# EAGLE design power_v2 (EAGLE 6.2)
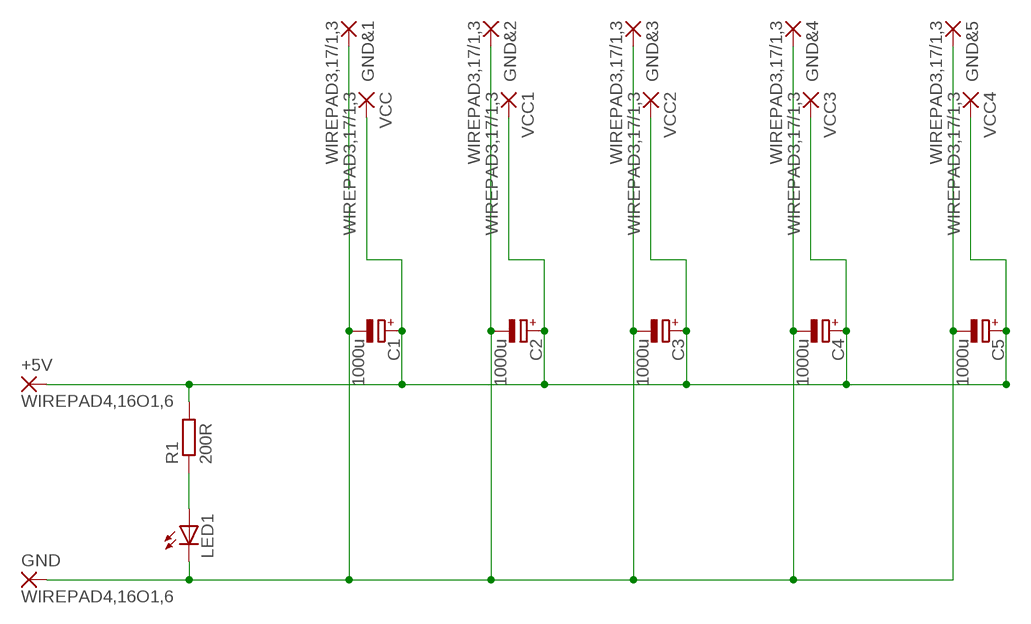
[diagram p0: schematic, sheet 1]

## Parts
+5V  WIREPAD4,16O1,6  [4,16O1,6]
C1  1000u  CPOL-EUE5-10.5  [E5-10,5]
C2  1000u  CPOL-EUE5-10.5  [E5-10,5]
C3  1000u  CPOL-EUE5-10.5  [E5-10,5]
C4  1000u  CPOL-EUE5-10.5  [E5-10,5]
C5  1000u  CPOL-EUE5-10.5  [E5-10,5]
GND  WIREPAD4,16O1,6  [4,16O1,6]
GND&1  WIREPAD3,17/1,3  [3,17/1,3]
GND&2  WIREPAD3,17/1,3  [3,17/1,3]
GND&3  WIREPAD3,17/1,3  [3,17/1,3]
GND&4  WIREPAD3,17/1,3  [3,17/1,3]
GND&5  WIREPAD3,17/1,3  [3,17/1,3]
LED1  LED5MM  [LED5MM]
R1  200R  R-EU_R1206  [R1206]
VCC  WIREPAD3,17/1,3  [3,17/1,3]
VCC1  WIREPAD3,17/1,3  [3,17/1,3]
VCC2  WIREPAD3,17/1,3  [3,17/1,3]
VCC3  WIREPAD3,17/1,3  [3,17/1,3]
VCC4  WIREPAD3,17/1,3  [3,17/1,3]

## Nets
GND: C1.- C2.- C3.- C4.- C5.- GND&2.1(P) GND&3.1(P) GND&4.1(P) GND&5.1(P) GND.1(P) LED1.K(C)
N$1: GND&1.1(P)
N$2: LED1.A R1.1
N$6: +5V.1(P) C1.+ C2.+ C3.+ C4.+ C5.+ R1.2 VCC1.1(P) VCC2.1(P) VCC3.1(P) VCC4.1(P) VCC.1(P)

## Library data of the parts
+5V GND GND&1-GND&5 VCC VCC1-VCC4 = wirepad:WIREPAD: Wire PAD connect wire on PCB
C1-C5 = resistor:CPOL-EU: POLARIZED CAPACITOR, European symbol
LED1 = led:LED: LED OSRAM: - CHIPLED LG R971, LG N971, LY N971, LG Q971, LY Q971, LO R971, LY R971 LH N974, LH R974 LS Q976, LO Q976, LY Q976 LO Q996 - Hyper CHIPLED LW Q18S LB Q993, LB Q99A, LB R99A - SideLED LS A670, LO A670, LY A670, LG A670, LP A670 LB A673, LV A673, LT A673, LW A673 LH A674 LY A675 LS A676, LA A676, LO A676, LY A676, LW A676 LS A679, LY A679, LG A679 - Hyper Micro SIDELED® LS Y876, LA Y876, LO Y876, LY Y876 LT Y87S - SmartLED LW L88C, LW L88S LB L89C, LB L89S, LG L890 LS L89K, LO L89K, LY L89K LS L896, LA L896, LO L896, LY L896 - TOPLED LS T670, LO T670, LY T670, LG T670, LP T670 LSG T670, LSP T670, LSY T670, LOP T670, LYG T670 LG T671, LOG T671, LSG T671 LB T673, LV T673, LT T673, LW T673 LH T674 LS T676, LA T676, LO T676, LY T676, LB T676, LH T676, LSB T676, LW T676 LB T67C, LV T67C, LT T67C, LS T67K, LO T67K, LY T67K, LW E67C LS E67B, LA E67B, LO E67B, LY E67B, LB E67C, LV E67C, LT E67C LW T67C LS T679, LY T679, LG T679 LS T770, LO T770, LY T770, LG T770, LP T770 LB T773, LV T773, LT T773, LW T773 LH T774 LS E675, LA E675, LY E675, LS T675 LS T776, LA T776, LO T776, LY T776, LB T776 LHGB T686 LT T68C, LB T68C - Hyper Mini TOPLED® LB M676 - Mini TOPLED Santana® LG M470 LS M47K, LO M47K, LY M47K Source: http://www.osram.convergy.de LUXEON: - LUMILED® LXK2-PW12-R00, LXK2-PW12-S00, LXK2-PW14-U00, LXK2-PW14-V00 LXK2-PM12-R00, LXK2-PM12-S00, LXK2-PM14-U00 LXK2-PE12-Q00, LXK2-PE12-R00, LXK2-PE12-S00, LXK2-PE14-T00, LXK2-PE14-U00 LXK2-PB12-K00, LXK2-PB12-L00, LXK2-PB12-M00, LXK2-PB14-N00, LXK2-PB14-P00, LXK2-PB14-Q00 LXK2-PR12-L00, LXK2-PR12-M00, LXK2-PR14-Q00, LXK2-PR14-R00 LXK2-PD12-Q00, LXK2-PD12-R00, LXK2-PD12-S00 LXK2-PH12-R00, LXK2-PH12-S00 LXK2-PL12-P00, LXK2-PL12-Q00, LXK2-PL12-R00 Source: www.luxeon.com KINGBRIGHT: KA-3528ASYC Source: www.kingbright.com
R1 = resistor:R-EU_: RESISTOR, European symbol

## Board
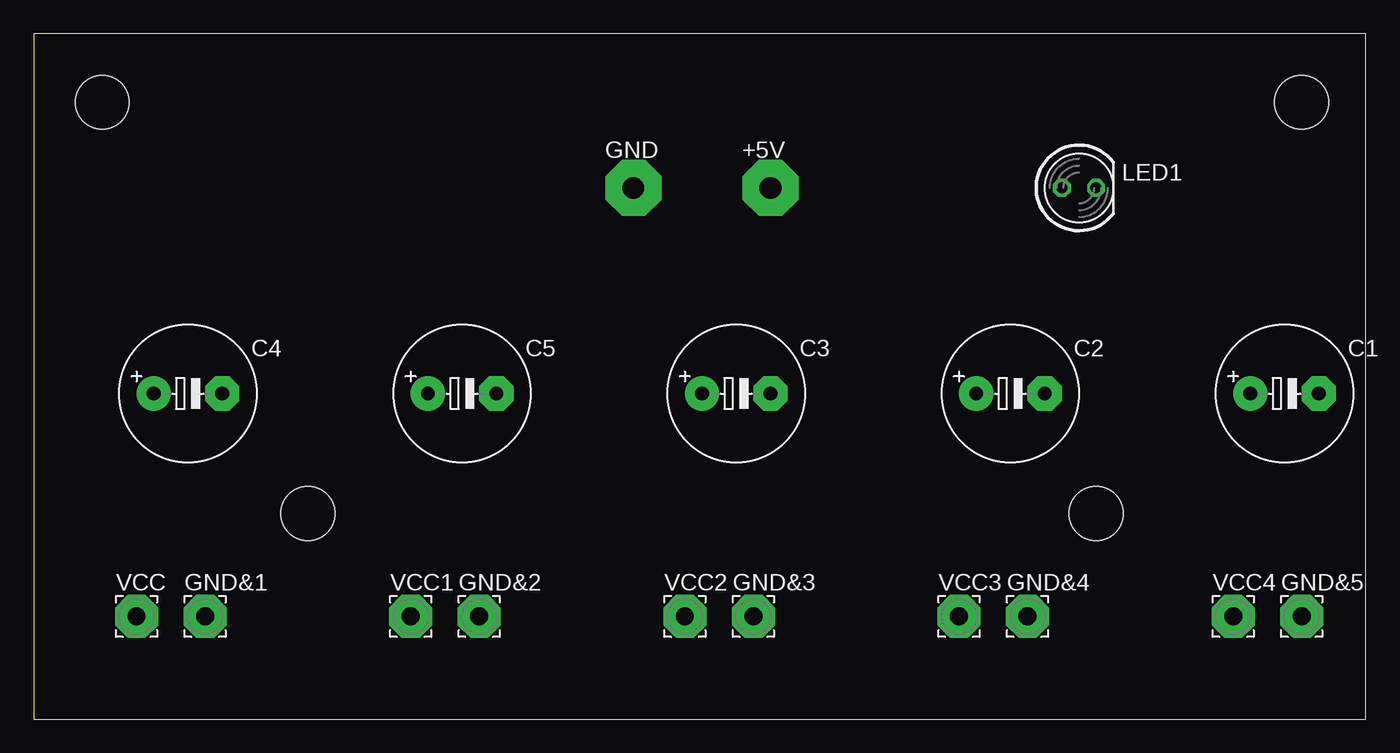
[diagram p1: board, top side]
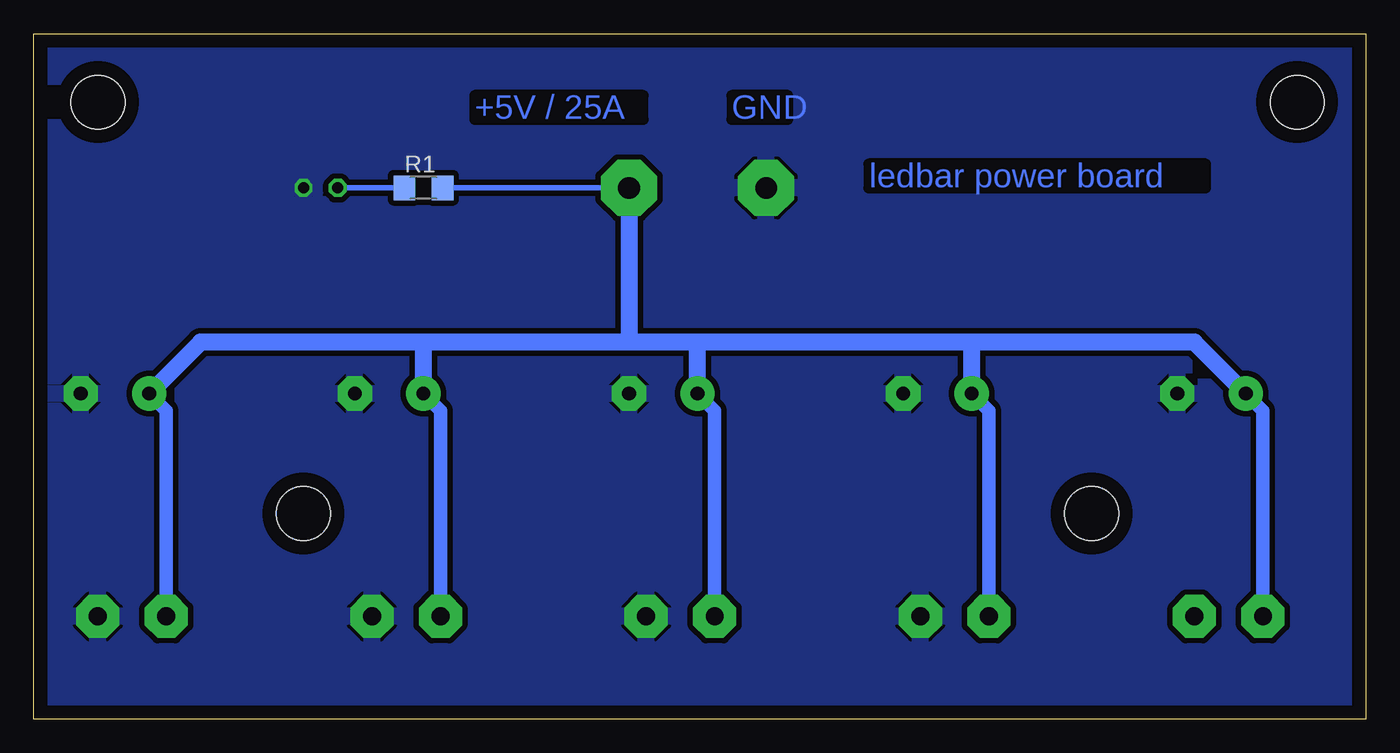
[diagram p2: board, bottom side, seen from below]

Size 98.73 x 50.79 mm. Coordinates in mm from the lower left corner, seen from the top.
Outline: 0,0 98.73,0 98.73,50.79 0,50.79 0,0
Copper layers (1*16): Top 0.035mm / dielectric 1.5mm / Bottom 0.035mm
Design rules: minimum track width 10mil, minimum drill 24mil, track to track 16mil, track to pad 16mil, pad to pad 16mil, via to via 16mil, smd to smd 8mil, copper to edge 40mil, drill to drill 8mil, minimum pad ring 10mil, minimum via ring 8mil, stop-mask expansion 4mil, vias tented up to drill 0mil, thermal gap 10mil
Holes 4 mm at 5.08,45.72 93.98,45.72 20.32,15.24 78.74,15.24

### Footprints (pad centres in the part's own frame; a part is rotated, then mirrored left to right if it is on the bottom)
4,16O1,6 = drill 1.6 pad 4.166 octagon: 1 0,0
E5-10,5 = drill 1.016 pad 2.54: + -2.54,0 | drill 1.016 pad 2.54 octagon: - 2.54,0
3,17/1,3 = drill 1.321 pad 3.175 octagon: 1 0,0
LED5MM = drill 0.813 octagon: A -1.27,0; K 1.27,0
R1206 = smd 1.6 x 1.803: 1 -1.422,0; 2 1.422,0

### Placement (x,y rotation side)
+5V  54.61,39.37 0 top
C1  92.71,24.13 0 top
C2  72.39,24.13 0 top
C3  52.07,24.13 0 top
C4  11.43,24.13 0 top
C5  31.75,24.13 0 top
GND  44.45,39.37 0 top
GND&1  12.7,7.62 0 top
GND&2  33.02,7.62 0 top
GND&3  53.34,7.62 0 top
GND&4  73.66,7.62 0 top
GND&5  93.98,7.62 0 top
LED1  77.47,39.37 0 top
R1  69.85,39.37 0 bottom
VCC  7.62,7.62 0 top
VCC1  27.94,7.62 0 top
VCC2  48.26,7.62 0 top
VCC3  68.58,7.62 0 top
VCC4  88.9,7.62 0 top

### Tracks (layer width: path | path; a pad name or v marks a point on that pad's centre or on a via)
GND
  pour Bottom: 0,50.8 99.06,50.8 99.06,-2.54 0,-2.54
N$2
  Bottom 0.406: R1.1 LED1.A
N$6
  Bottom 0.406: R1.2 +5V.1
  Bottom 1.016: C2.+ 68.58,22.86 VCC3.1 | C1.+ 88.9,22.86 VCC4.1 | C3.+ 48.26,22.86 VCC2.1 | C5.+ 27.94,22.86 VCC1.1 | C4.+ 7.62,22.86 VCC.1
  Bottom 1.27: C4.+ 12.7,27.94 29.21,27.94 | 29.21,27.94 49.53,27.94 | 49.53,27.94 54.61,27.94 | 54.61,27.94 69.85,27.94 | 69.85,27.94 86.36,27.94 C1.+ | C2.+ 69.85,27.94 | C3.+ 49.53,27.94 | C5.+ 29.21,27.94 | +5V.1 54.61,27.94

### Text on the board
Bottom: GND | +5V / 25A | ledbar power board